# EAGLE design CargaSecundaria (EAGLE 9.6.2)
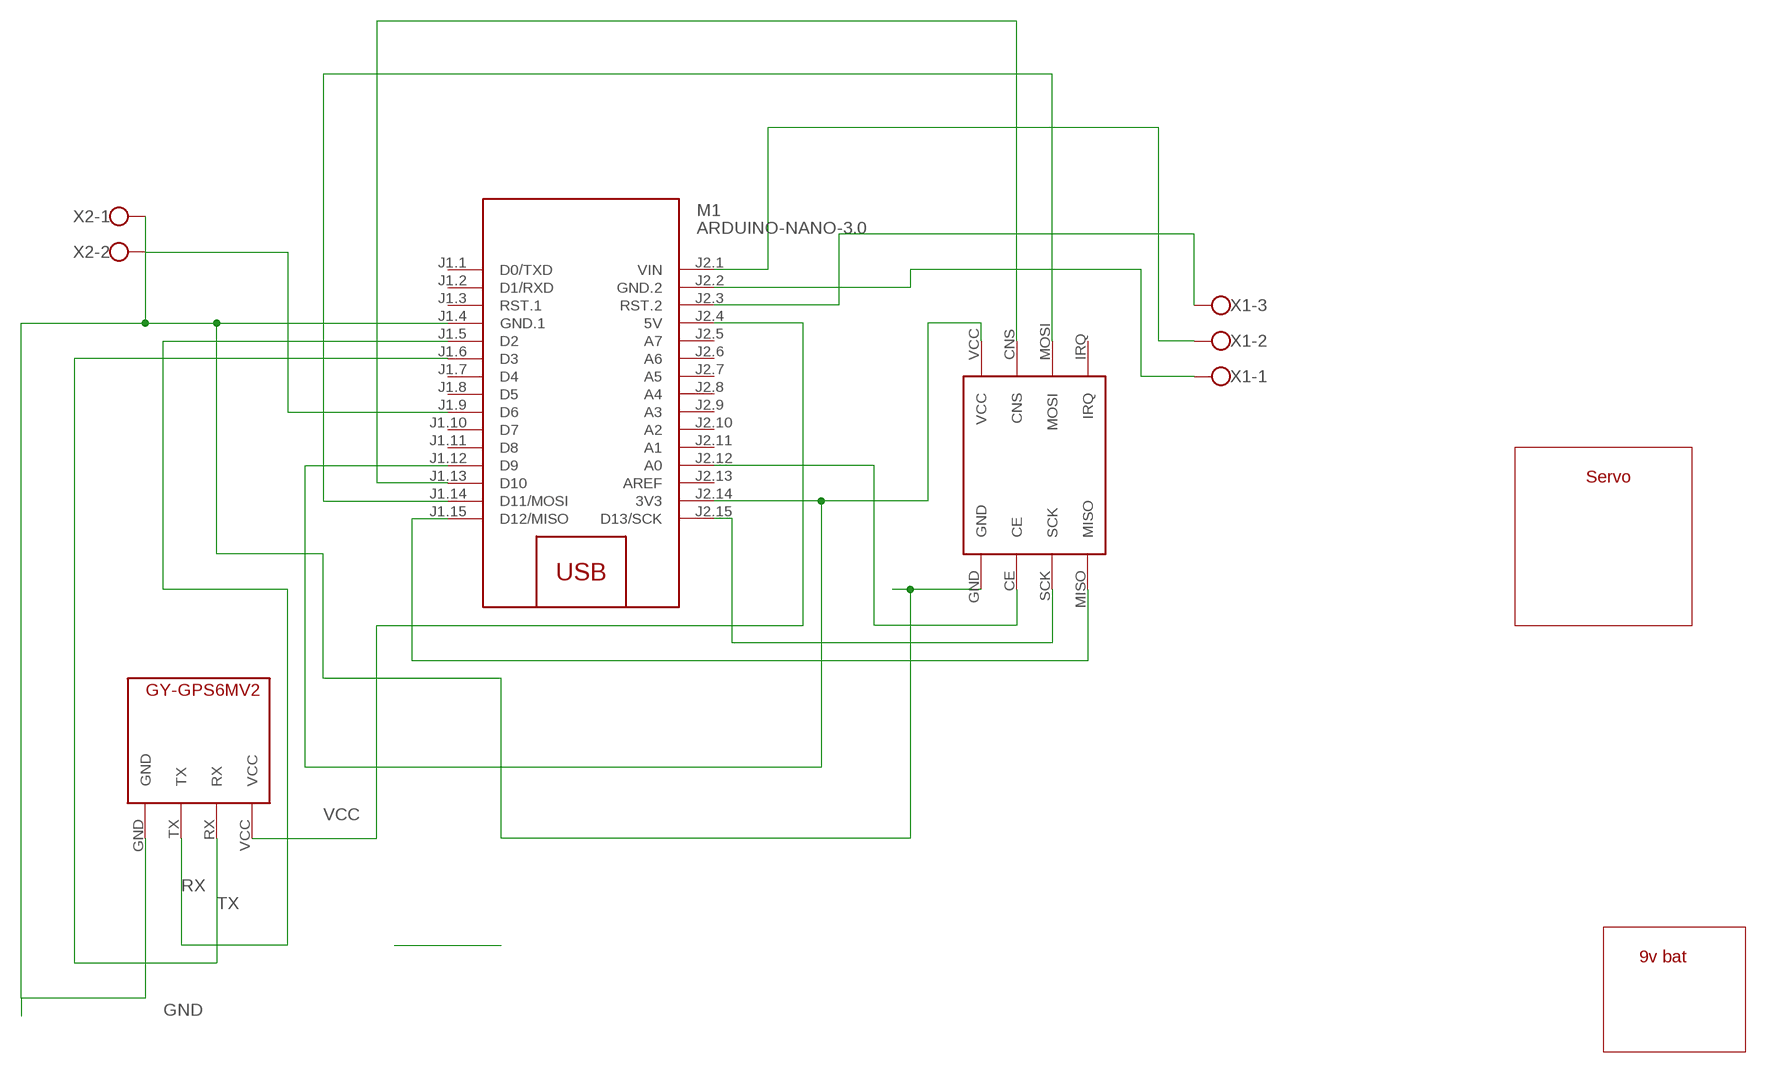
[diagram p0: schematic, sheet 1]

## Parts
M1  ARDUINO-NANO-3.0  [ARDUINO-NANO-3.0]
U$2  SERVO_DEVICE  [SERVO_FOOTPRINT]
U$3  NRF24L01_DEVICE  [NRF24L01_FOOTPRINT]
U$4  9VBAT_DEVICE  [9V_FOOTRPRINT]
U$5  GY-GPS6M_VUPDOWMNLIB  [GY-GPS6M_FOOTPRINT_UPSIDEDOWN]
X1  W237-103  [W237-103]
X2  W237-102  [W237-102]

## Nets
GND: M1.J1.4(GND.1) U$3.GND U$5.GND X2.1
N$1: M1.J1.13(D10) U$3.CNS
N$2: M1.J2.3(RST.2) X1.3
N$4: M1.J1.9(D6) X2.2
N$5: M1.J1.12(D9) M1.J2.14(3V3) U$3.VCC
N$8: M1.J2.2(GND.2) X1.1
N$9: M1.J2.1(VIN) X1.2
N$11: M1.J2.15(D13/SCK) U$3.SCK
N$12: M1.J2.12(A0) U$3.CE
N$13: M1.J1.15(D12/MISO) U$3.MISO
N$14: M1.J1.14(D11/MOSI) U$3.MOSI
RX: M1.J1.5(D2) U$5.TX
TX: M1.J1.6(D3) U$5.RX
VCC: M1.J2.4(5V) U$5.VCC
Unconnected: M1.J1.1(D0/TXD) M1.J1.2(D1/RXD) M1.J1.3(RST.1) M1.J1.7(D4) M1.J1.8(D5) M1.J1.10(D7) M1.J1.11(D8) M1.J2.5(A7) M1.J2.6(A6) M1.J2.7(A5) M1.J2.8(A4) M1.J2.9(A3) M1.J2.10(A2) M1.J2.11(A1) M1.J2.13(AREF) U$3.IRQ

## Library data of the parts
M1 = diy-modules:ARDUINO-NANO-3.0: Arduino Nano 3.0
U$2 = sERVO:SERVO_DEVICE
U$3 = NRF24L01:NRF24L01_DEVICE
U$4 = 9vbat:9VBAT_DEVICE
U$5 = GY-GPS6M2:GY-GPS6M_VUPDOWMNLIB
X1 = con-wago-500:W237-103: WAGO SCREW CLAMP; MPN: 237-103; OC_FARNELL: unknown; OC_NEWARK: 18M7116
X2 = con-wago-500:W237-102: WAGO SCREW CLAMP; MPN: 237-102; OC_FARNELL: unknown; OC_NEWARK: 70K9898

## Board
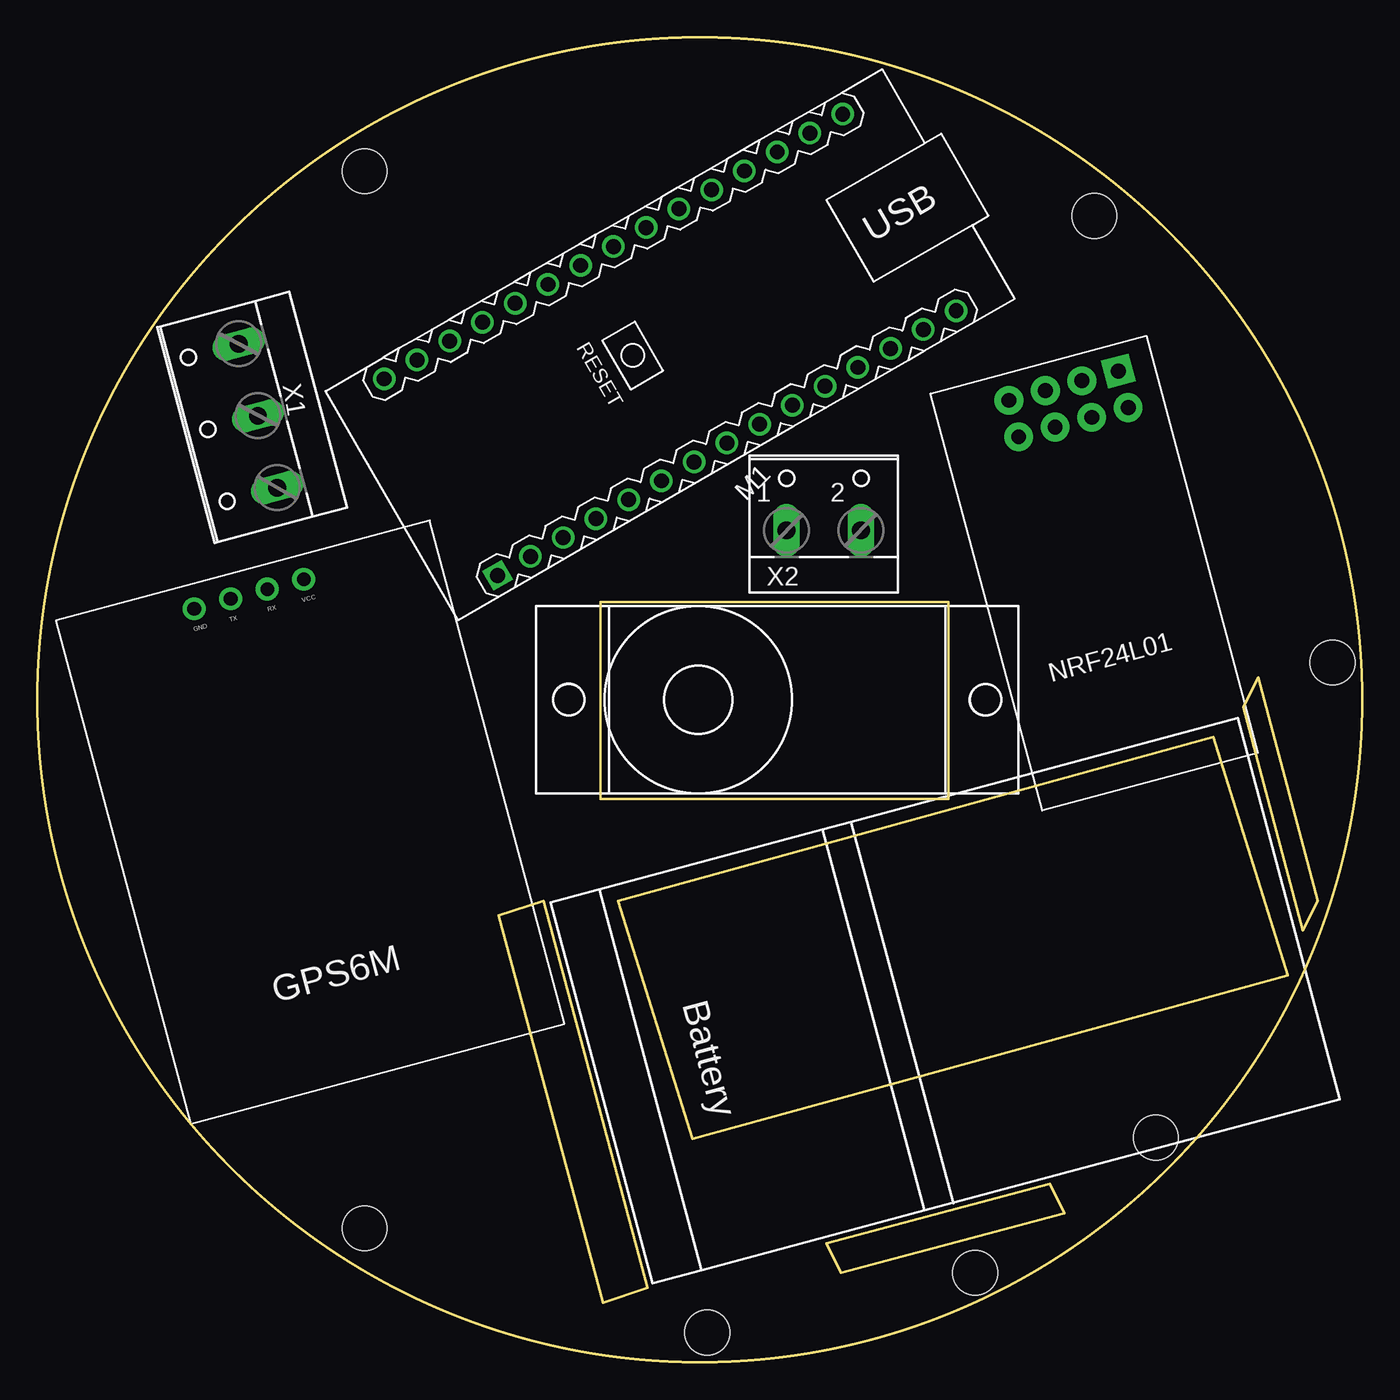
[diagram p1: board, top side]
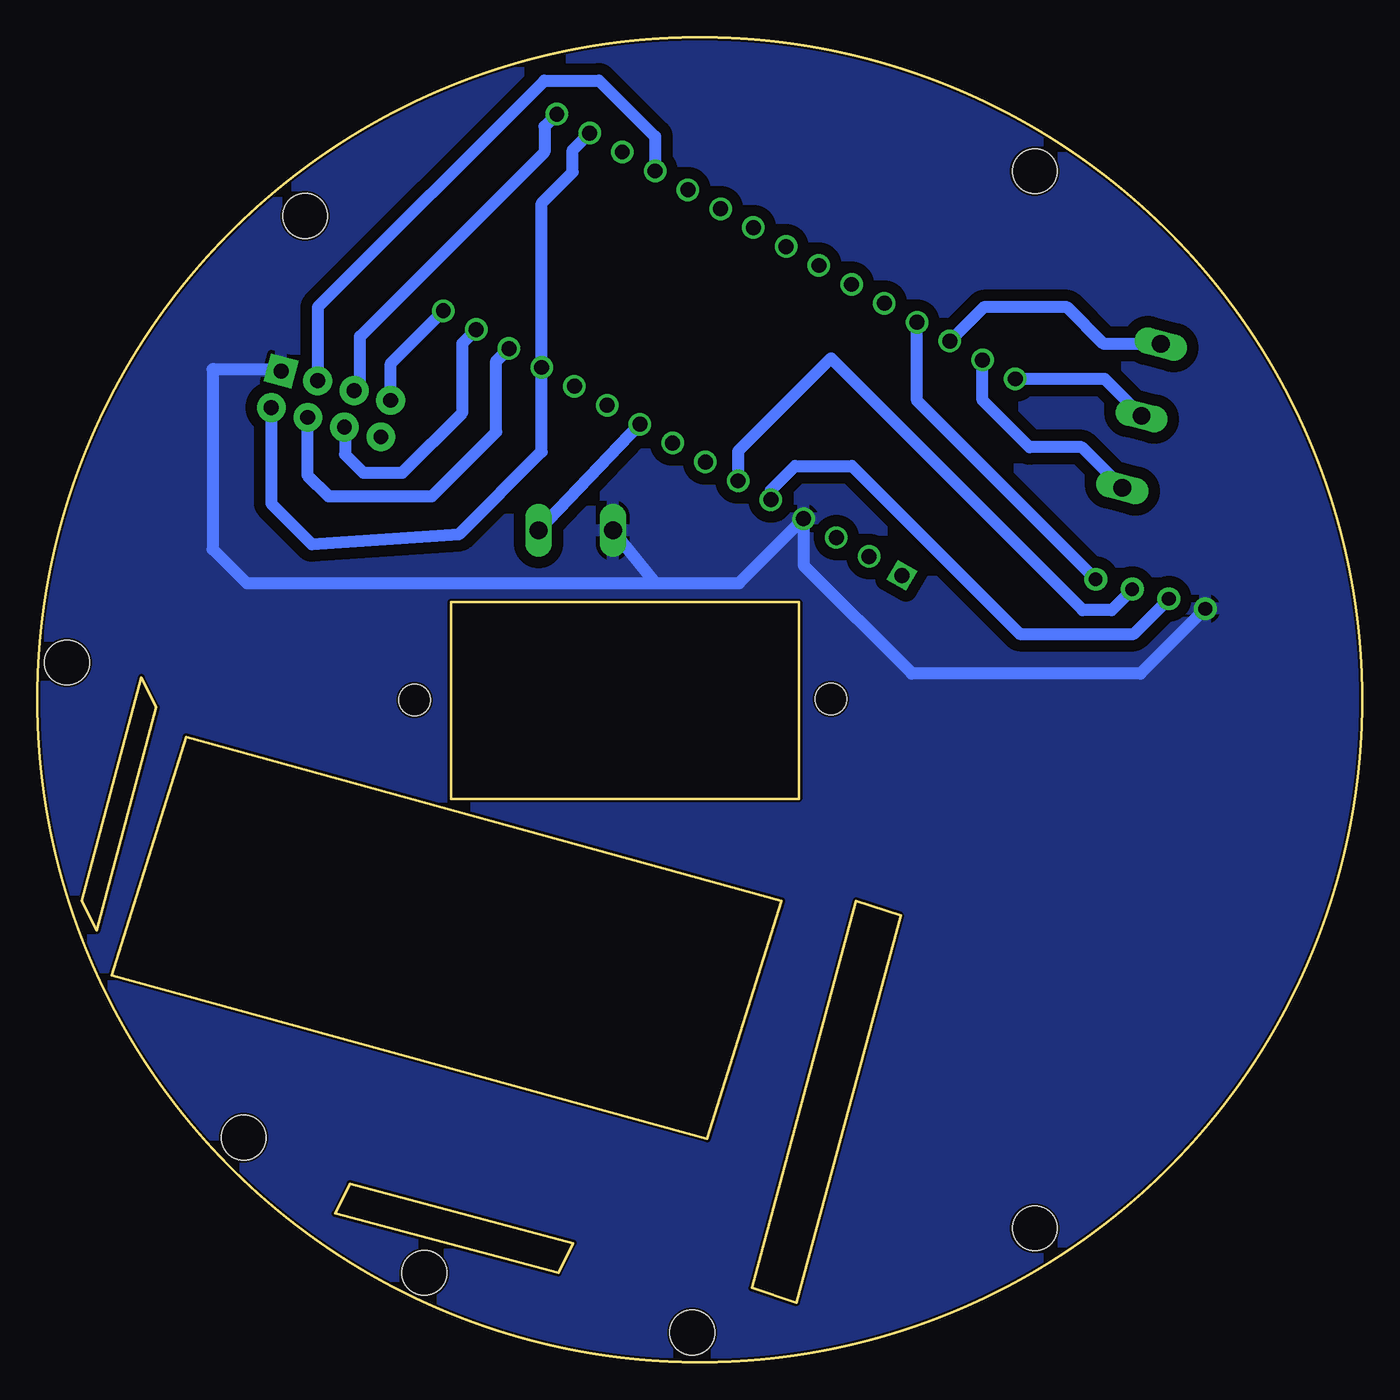
[diagram p2: board, bottom side, seen from below]

Size 89 x 89 mm. Coordinates in mm from the lower left corner, seen from the top.
Outline: 37.85,51.05 37.85,37.85 61.21,37.85 61.21,51.05 37.85,51.05
Outline: 34,31 41,5 38,4 31,30 34,31
Outline: 81,44 85,29 86,31 82,46 81,44
Outline: 53,8 68,12 69,10 54,6 53,8
Outline: 39,31 79,42 84,26 44,15 39,31
Outline: circle at 44.5,44.5 radius 44.5
Copper layers (1*16): Top 0.035mm / dielectric 1.5mm / Bottom 0.035mm
Design rules "default *": minimum track width 10mil, minimum drill 0.35mm, track to track 30mil, track to pad 32mil, pad to pad 6mil, via to via 6mil, smd to smd 6mil, copper to edge 6mil, drill to drill 6mil, minimum pad ring 10mil, minimum via ring 8mil, stop-mask expansion 4mil, vias tented up to drill 0mil, thermal gap 10mil
Holes 3 mm at 71,77 22,80 22,9 63,6 87,47 45,2 75.13,15.1
Holes 2.1 mm at 35.69,44.55 63.65,44.48

### Footprints (pad centres in the part's own frame; a part is rotated, then mirrored left to right if it is on the bottom)
ARDUINO-NANO-3.0 = drill 1 square: J1.1 17.78,7.62 | drill 1: J1.2 15.24,7.62; J1.3 12.7,7.62; J1.4 10.16,7.62; J1.5 7.62,7.62; J1.6 5.08,7.62; J1.7 2.54,7.62; J1.8 0,7.62; J1.9 -2.54,7.62; J1.10 -5.08,7.62; J1.11 -7.62,7.62; J1.12 -10.16,7.62; J1.13 -12.7,7.62; J1.14 -15.24,7.62; J1.15 -17.78,7.62; J2.1 17.78,-7.62; J2.2 15.24,-7.62; J2.3 12.7,-7.62; J2.4 10.16,-7.62; J2.5 7.62,-7.62; J2.6 5.08,-7.62; J2.7 2.54,-7.62; J2.8 0,-7.62; J2.9 -2.54,-7.62; J2.10 -5.08,-7.62; J2.11 -7.62,-7.62; J2.12 -10.16,-7.62; J2.13 -12.7,-7.62; J2.14 -15.24,-7.62; J2.15 -17.78,-7.62
NRF24L01_FOOTPRINT = drill 1 pad 1.93: CE -2.54,-12.7; CNS -2.54,-10.16; IRQ 2.54,-10.16; MISO 2.54,-12.7; MOSI 0,-10.16; SCK 0,-12.7; VCC -5.08,-10.16 | drill 1 pad 1.93 square: GND -5.08,-12.7
GY-GPS6M_FOOTPRINT_UPSIDEDOWN = drill 0.91 pad 1.524: GND 9.19,33.375; RX 14.27,33.375; TX 11.73,33.375; VCC 16.81,33.375
W237-103 = drill 1.194 long: 1 -5,-1.29; 2 0,-1.29; 3 5,-1.29
W237-102 = drill 1.194 long: 1 -2.5,-1.27; 2 2.5,-1.27

### Placement (x,y rotation side)
M1  42.51,68.34 210 top
U$2  49.7,44.5 180 top
U$3  71,53 195 top
U$4  60.99,24.29 105 top
U$5  10.3,16 15 top
X1  13.58,63.24 105 top
X2  52.83,57.15 0 top

### Tracks (layer width: path | path; a pad name or v marks a point on that pad's centre or on a via)
GND
  Bottom 0.813: U$5.GND 14.9,46.25 30.25,46.25 37.52,53.52 M1.J1.4 41.86,52.32 47.47,52.32 | U$3.GND 72.76,66.72 77.18,66.72 77.22,66.69 77.22,54.61 74.93,52.32 47.47,52.32 | X2.1 47.47,52.32
  pour Bottom: 0,0 0,89.81 82.75,89.81 90.09,89.81 90.09,0.91 90.09,0
N$1
  Bottom 0.813: U$3.CNS 70.86,63.43 70.86,59.6 69.43,58.17 62.48,58.17 58.17,62.48 58.17,67.25 M1.J1.13
N$2
  Bottom 0.813: X1.3 17.35,68.4 19.81,70.87 25.43,70.87 M1.J2.3
N$4
  Bottom 0.813: X2.2 M1.J1.9
N$5
  Bottom 0.813: U$3.VCC 73.28,57.68 70.55,54.96 60.64,55.64 55.12,61.16 M1.J1.12 55.12,77.85 53.03,79.94 53.03,81.43 M1.J2.14
N$8
  Bottom 0.813: X1.1 18.85,61.47 22.35,61.47 25.5,64.62 M1.J2.2
N$9
  Bottom 0.813: X1.2 17.3,66.05 M1.J2.1
N$11
  Bottom 0.813: U$3.SCK 67.33,65.65 67.33,68.9 54.94,81.29 54.94,82.99 M1.J2.15
N$12
  Bottom 0.813: U$3.CE 70.17,70.87 54.94,86.09 51.27,86.09 47.5,82.33 M1.J2.12
N$13
  Bottom 0.813: U$3.MISO 65.26,67.09 M1.J1.15
N$14
  Bottom 0.813: U$3.MOSI 68.33,62.77 68.33,60.97 67.1,59.74 64.48,59.74 60.43,63.79 60.43,68.45 M1.J1.14
RX
  Bottom 0.813: U$5.TX 15.35,48.92 23.01,48.92 34.29,60.2 38.1,60.2 39.72,58.58 M1.J1.5
TX
  Bottom 0.813: U$5.RX 15.45,51.9 16.83,50.52 18.77,50.52 35.69,67.44 41.92,61.2 M1.J1.6
VCC
  Bottom 0.813: U$5.VCC 29.9,64.59 M1.J2.4